# EAGLE schematic zx80 SD_12 (smd) build006.7(STM32) (EAGLE 9.6.2)

## Sheet 1 of 2
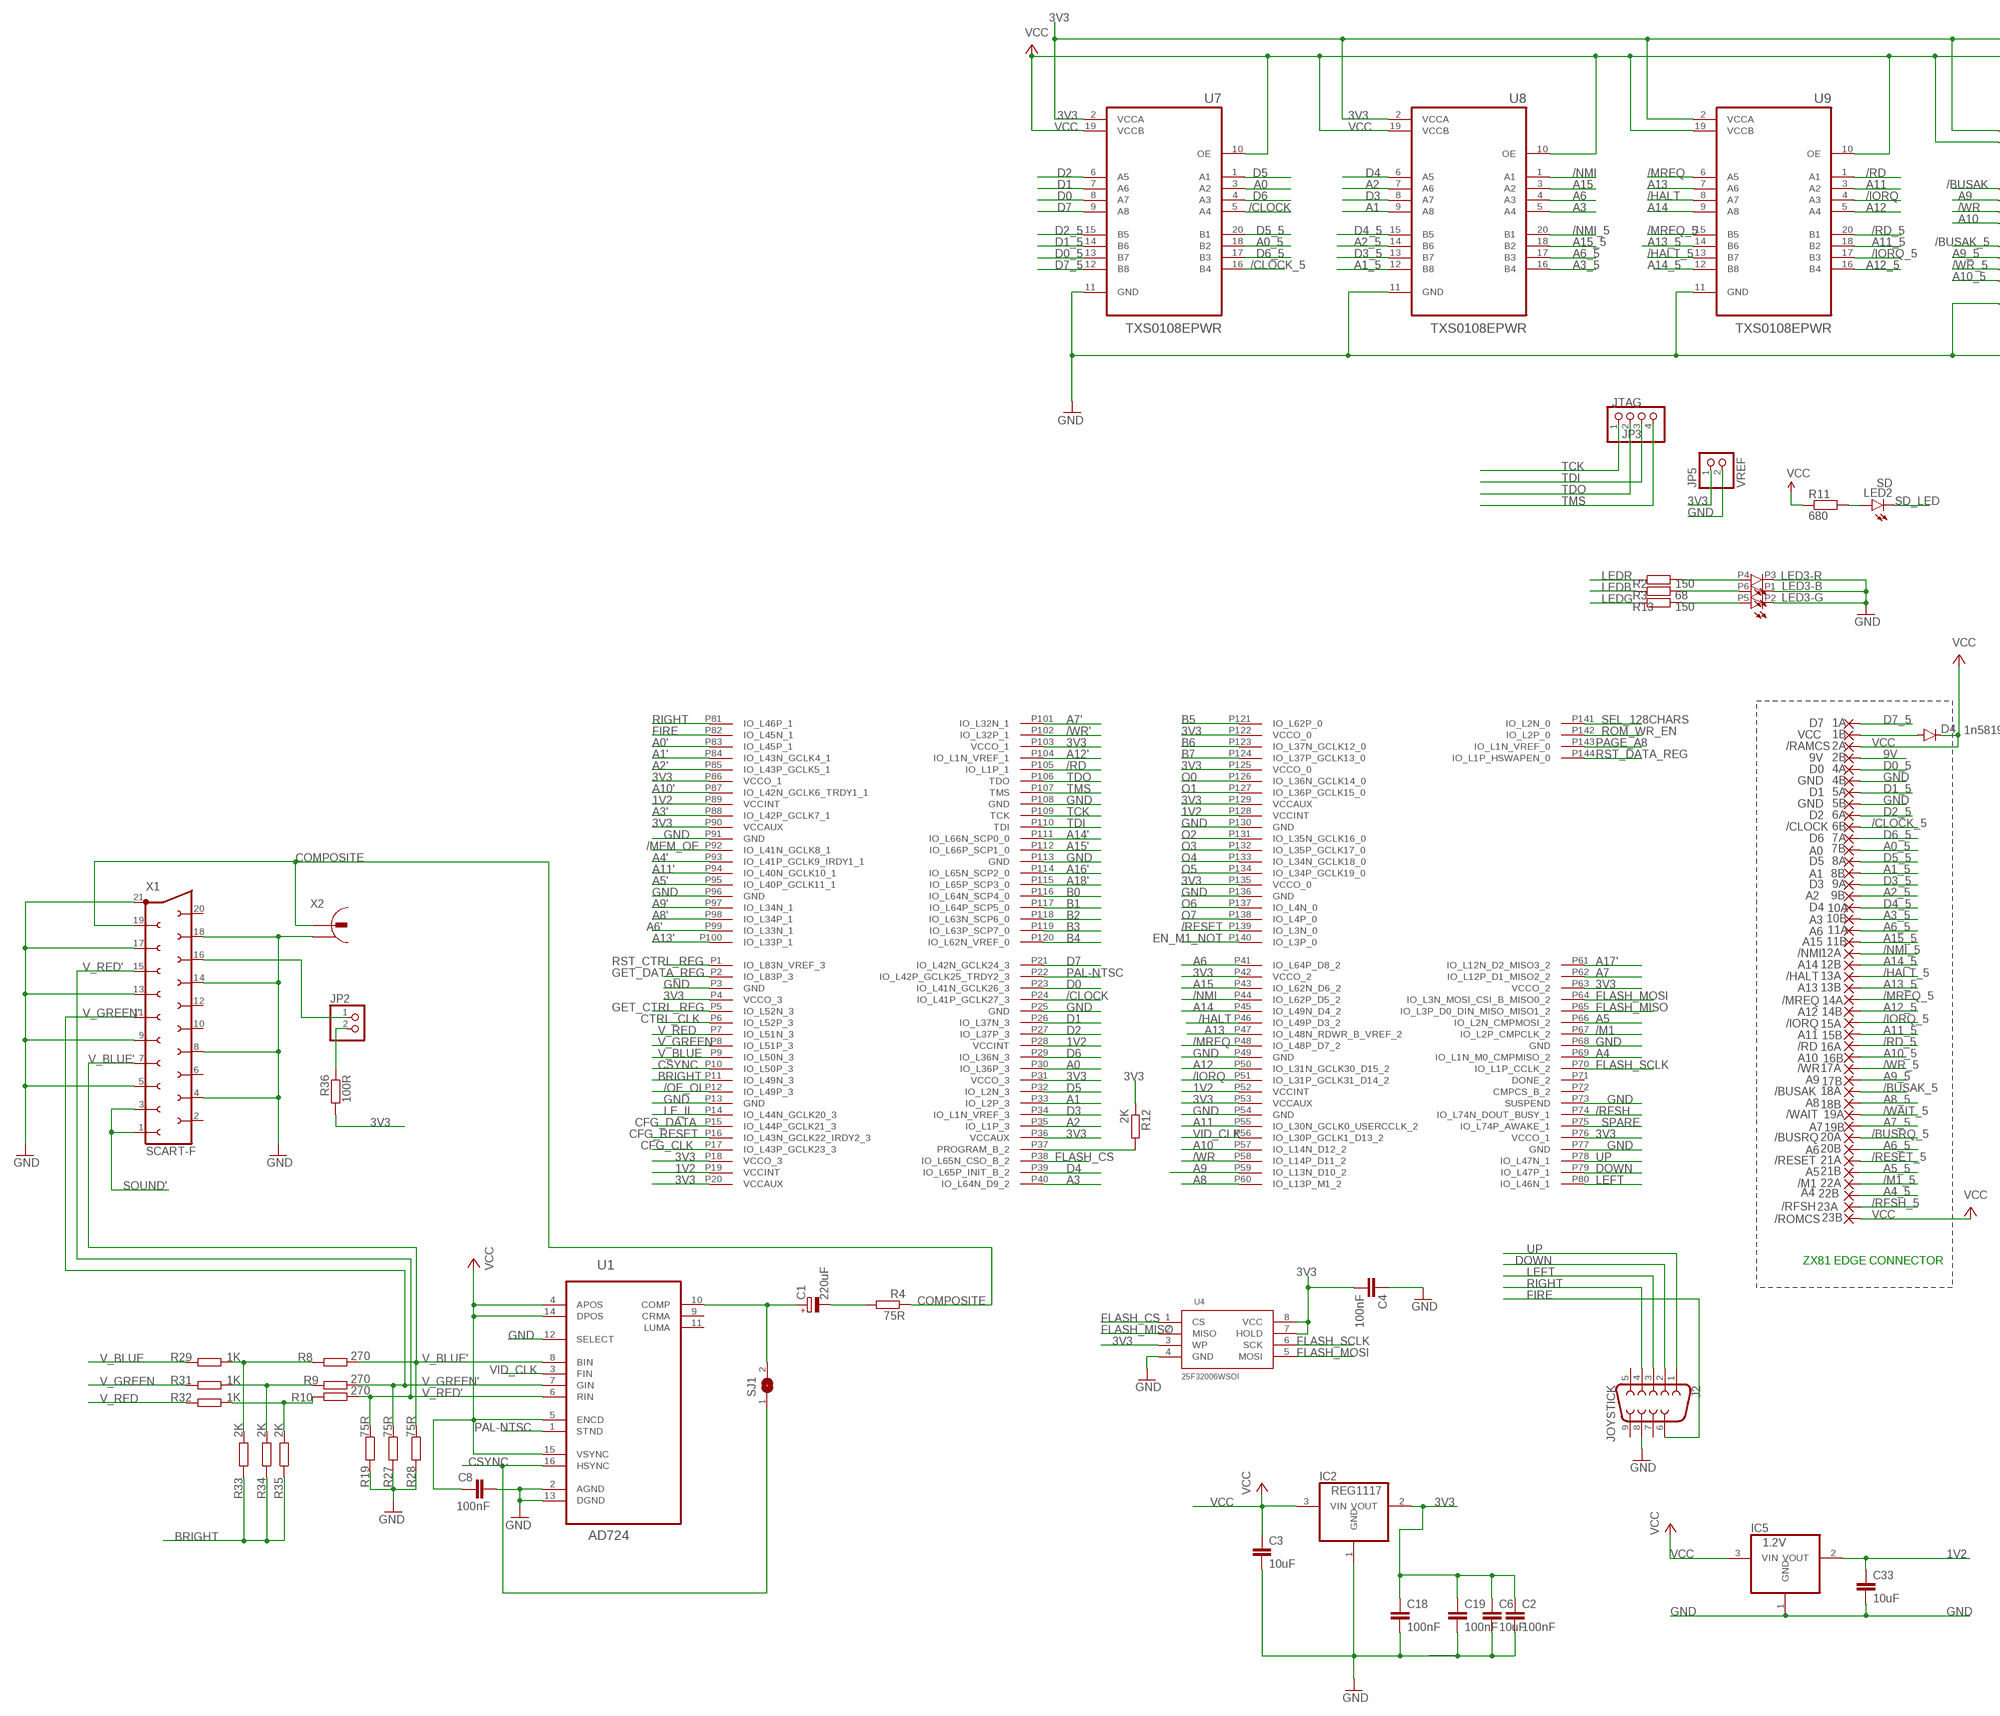
[diagram p0: schematic, sheet 1, part 1 of 2]
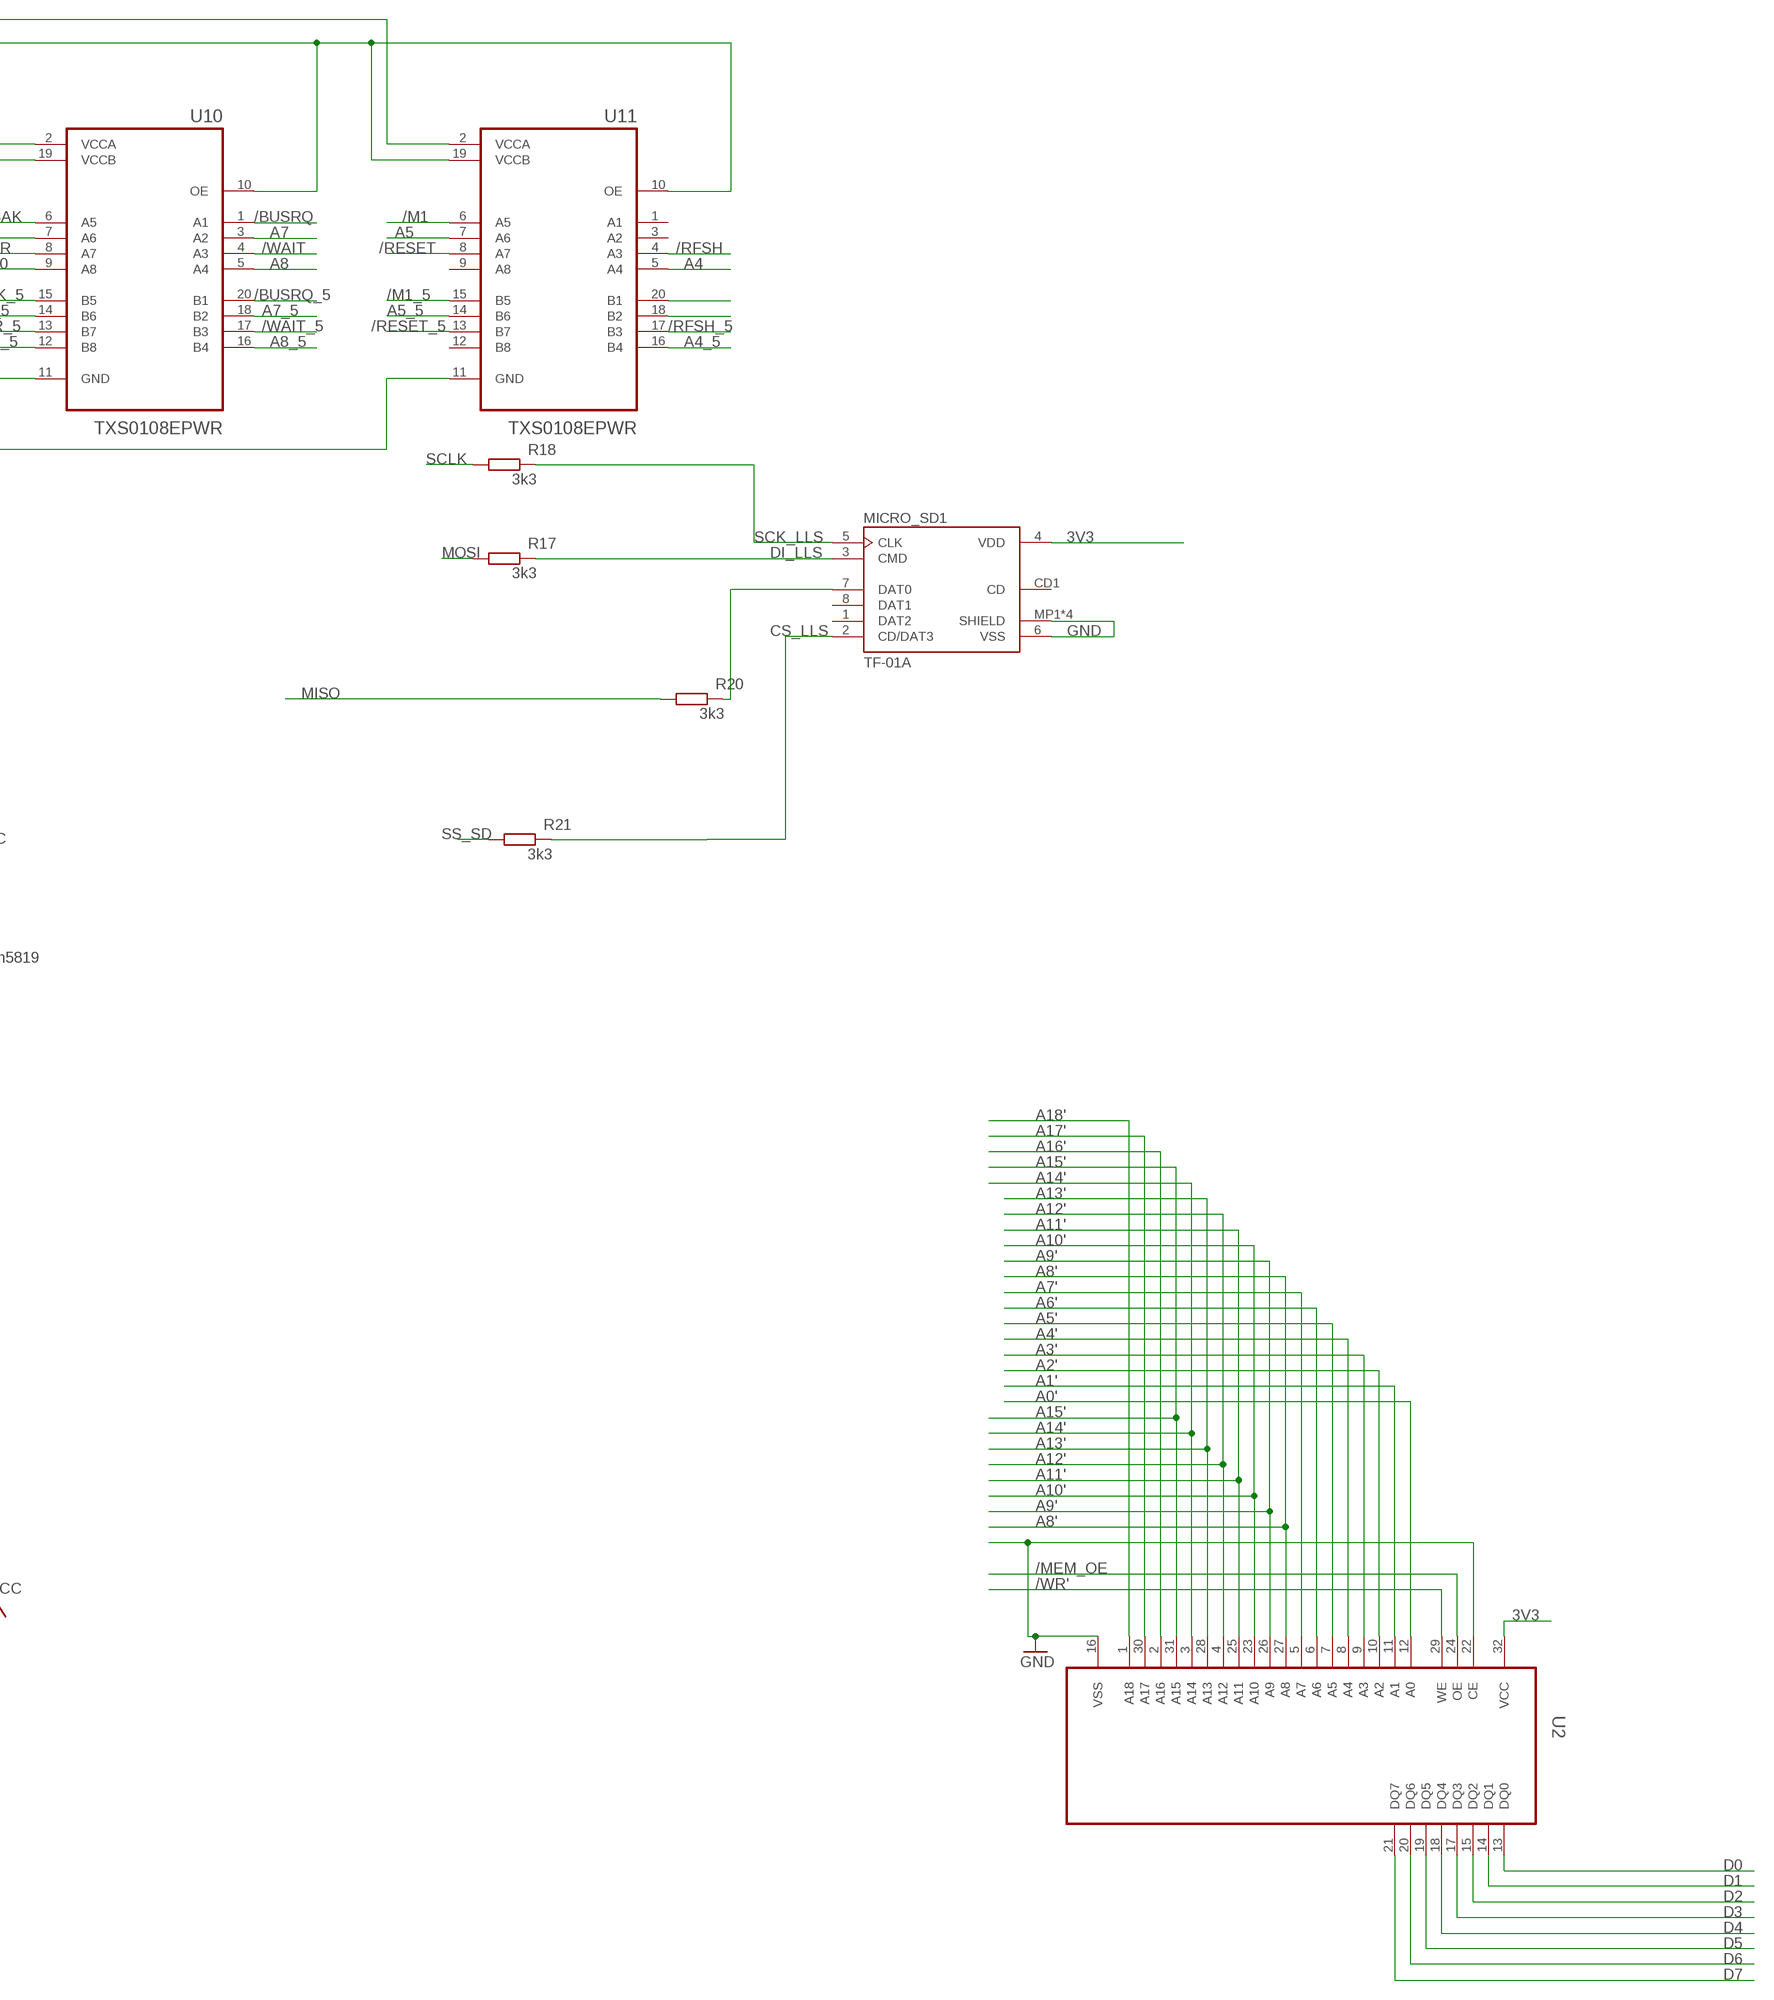
[diagram p1: schematic, sheet 1, part 2 of 2]

### Parts
1A  D7  SMD2EDGEPIN  [EDGEPIN]
1B  VCC  SMD2EDGEPIN  [EDGEPIN]
2A  /RAMCS  SMD2EDGEPIN  [EDGEPIN]
2B  9V  SMD2EDGEPIN  [EDGEPIN]
4A  D0  SMD2EDGEPIN  [EDGEPIN]
4B  GND  SMD2EDGEPIN  [EDGEPIN]
5A  D1  SMD2EDGEPIN  [EDGEPIN]
5B  GND  SMD2EDGEPIN  [EDGEPIN]
6A  D2  SMD2EDGEPIN  [EDGEPIN]
6B  /CLOCK  SMD2EDGEPIN  [EDGEPIN]
7A  D6  SMD2EDGEPIN  [EDGEPIN]
7B  A0  SMD2EDGEPIN  [EDGEPIN]
8A  D5  SMD2EDGEPIN  [EDGEPIN]
8B  A1  SMD2EDGEPIN  [EDGEPIN]
9A  D3  SMD2EDGEPIN  [EDGEPIN]
9B  A2  SMD2EDGEPIN  [EDGEPIN]
10A  D4  SMD2EDGEPIN  [EDGEPIN]
10B  A3  SMD2EDGEPIN  [EDGEPIN]
11A  A6  SMD2EDGEPIN  [EDGEPIN]
11B  A15  SMD2EDGEPIN  [EDGEPIN]
12A  /NMI  SMD2EDGEPIN  [EDGEPIN]
12B  A14  SMD2EDGEPIN  [EDGEPIN]
13A  /HALT  SMD2EDGEPIN  [EDGEPIN]
13B  A13  SMD2EDGEPIN  [EDGEPIN]
14A  /MREQ  SMD2EDGEPIN  [EDGEPIN]
14B  A12  SMD2EDGEPIN  [EDGEPIN]
15A  /IORQ  SMD2EDGEPIN  [EDGEPIN]
15B  A11  SMD2EDGEPIN  [EDGEPIN]
16A  /RD  SMD2EDGEPIN  [EDGEPIN]
16B  A10  SMD2EDGEPIN  [EDGEPIN]
17A  /WR  SMD2EDGEPIN  [EDGEPIN]
17B  A9  SMD2EDGEPIN  [EDGEPIN]
18A  /BUSAK  SMD2EDGEPIN  [EDGEPIN]
18B  A8  SMD2EDGEPIN  [EDGEPIN]
19A  /WAIT  SMD2EDGEPIN  [EDGEPIN]
19B  A7  SMD2EDGEPIN  [EDGEPIN]
20A  /BUSRQ  SMD2EDGEPIN  [EDGEPIN]
20B  A6  SMD2EDGEPIN  [EDGEPIN]
21A  /RESET  SMD2EDGEPIN  [EDGEPIN]
21B  A5  SMD2EDGEPIN  [EDGEPIN]
22A  /M1  SMD2EDGEPIN  [EDGEPIN]
22B  A4  SMD2EDGEPIN  [EDGEPIN]
23A  /RFSH  SMD2EDGEPIN  [EDGEPIN]
23B  /ROMCS  SMD2EDGEPIN  [EDGEPIN]
C1  220uF  CPOL-EUUD-6,3X7,7  [UD-6,3X7,7_NICHICON]
C2  100nF  C-EUC0603  [C0603]
C3  10uF  C-EUC0603  [C0603]
C4  100nF  C-EUC0603  [C0603]
C6  10uF  C-EUC0603  [C0603]
C8  100nF  C-EUC0603K  [C0603K]
C18  100nF  C-EUC0603  [C0603]
C19  100nF  C-EUC0603  [C0603]
C33  10uF  C-EUC0603  [C0603]
D4  1n5819  DIODE-SOD323-W  [SOD323-W]
IC2  REG1117  [SOT223]
IC5  1.2V  REG1117  [SOT223]
J2  JOYSTICK  DB9MALE  [DB9_MALE]
JP2  PINHD-1X2  [1X02]
JP3  JTAG  PINHD-1X4  [1X04]
JP5  VREF  PINHD-1X2  [1X02]
LED2  SD  LEDCHIPLED_0805  [CHIPLED_0805]
LED3  STATUS  3535RGB3535RGB  [3535-PLCC6]
MICRO_SD1  TF-01A  [TF-01A]
R2  150  R-EU_R0603  [R0603]
R3  68  R-EU_R0603  [R0603]
R4  75R  R-EU_R0603  [R0603]
R8  270  R-EU_R0603  [R0603]
R9  270  R-EU_R0603  [R0603]
R10  270  R-EU_R0603  [R0603]
R11  680  R-EU_R0603  [R0603]
R12  2K  R-EU_R0402  [R0402]
R13  150  R-EU_R0603  [R0603]
R17  3k3  R-EU_R0603  [R0603]
R18  3k3  R-EU_R0603  [R0603]
R19  75R  R-EU_R0603  [R0603]
R20  3k3  R-EU_R0603  [R0603]
R21  3k3  R-EU_R0603  [R0603]
R27  75R  R-EU_R0603  [R0603]
R28  75R  R-EU_R0603  [R0603]
R29  1K  R-EU_R0402  [R0402]
R31  1K  R-EU_R0402  [R0402]
R32  1K  R-EU_R0402  [R0402]
R33  2K  R-EU_R0402  [R0402]
R34  2K  R-EU_R0402  [R0402]
R35  2K  R-EU_R0402  [R0402]
R36  100R  R-EU_R0603  [R0603]
SJ1  SJ  [SJ]
U1  AD724  AD724JRZ  [SOIC127P1032X265-16N]
U2  AS6C4008  AS6C4008-55SINSOP5  [SOP32-5]
U4  25F32006WSOI  SPI_FLASH-X25XXSMD1  [SO08-EIAJ]
U6  XC6SLX9-2TQG144C  [TQ144]
U7  TXS0108EPWR  [SOP65P640X120-20N]
U8  TXS0108EPWR  [SOP65P640X120-20N]
U9  TXS0108EPWR  [SOP65P640X120-20N]
U10  TXS0108EPWR  [SOP65P640X120-20N]
U11  TXS0108EPWR  [SOP65P640X120-20N]
X1  SCART-F  [SCART-F]
X2  CON-CONRAD_736880-2P  [3P]

### Nets
1V2 [VCC]: C33.1 IC5.2(VOUT) U6.P19(VCCINT) U6.P28(VCCINT) U6.P52(VCCINT) U6.P89(VCCINT) U6.P128(VCCINT)
3V3 [VCC]: C2.1 C4.2 C6.1 C18.1 C19.1 IC2.2(VOUT) JP5.1 MICRO_SD1.4(VDD) R12.1 R36.2 U2.32(VCC) U4.3(WP) U4.7(HOLD) U4.8(VCC) U6.P4(VCCO_3) U6.P18(VCCO_3) U6.P20(VCCAUX) U6.P31(VCCO_3) U6.P36(VCCAUX) U6.P42(VCCO_2) U6.P53(VCCAUX) U6.P63(VCCO_2) U6.P76(VCCO_1) U6.P86(VCCO_1) U6.P90(VCCAUX) U6.P103(VCCO_1) U6.P122(VCCO_0) U6.P125(VCCO_0) U6.P129(VCCAUX) U6.P135(VCCO_0) U7.2(VCCA) U8.2(VCCA) U9.2(VCCA) U10.2(VCCA) U11.2(VCCA) ; also sheet 2
9V [VCC]: 2B.1(P)
/BUSAK: U10.6(A5)
/BUSAK_5: 18A.1(P) U10.15(B5)
/BUSRQ: U10.1(A1)
/BUSRQ_5: 20A.1(P) U10.20(B1)
/CLOCK: U6.P24(IO_L41P_GCLK27_3) U7.5(A4)
/CLOCK_5: 6B.1(P) U7.16(B4)
/HALT: U6.P46(IO_L49P_D3_2) U9.8(A7)
/HALT_5: 13A.1(P) U9.13(B7)
/IORQ: U6.P51(IO_L31P_GCLK31_D14_2) U9.4(A3)
/IORQ_5: 15A.1(P) U9.17(B3)
/M1: U6.P67(IO_L2P_CMPCLK_2) U11.6(A5)
/M1_5: 22A.1(P) U11.15(B5)
/MEM_OE: U2.24(OE) U6.P92(IO_L41N_GCLK8_1)
/MREQ: U6.P48(IO_L48P_D7_2) U9.6(A5)
/MREQ_5: 14A.1(P) U9.15(B5)
/NMI: U6.P44(IO_L62P_D5_2) U8.1(A1)
/NMI_5: 12A.1(P) U8.20(B1)
/OE_OL: U6.P12(IO_L49P_3) ; also sheet 2
/RD: U6.P105(IO_L1P_1) U9.1(A1)
/RD_5: 16A.1(P) U9.20(B1)
/RESET: U6.P139(IO_L3N_0) U11.8(A7) ; also sheet 2
/RESET_5: 21A.1(P) U11.13(B7)
/RFSH: U6.P74(IO_L74N_DOUT_BUSY_1) U11.4(A3)
/RFSH_5: 23A.1(P) U11.17(B3)
/WAIT: U10.4(A3) ; also sheet 2
/WAIT_5: 19A.1(P) U10.17(B3)
/WR: U6.P58(IO_L14P_D11_2) U10.8(A7)
/WR': U2.29(WE) U6.P102(IO_L32P_1) ; also sheet 2
/WR_5: 17A.1(P) U10.13(B7)
A0: U6.P30(IO_L36P_3) U7.3(A2)
A0': U2.12(A0) U6.P83(IO_L45P_1) ; also sheet 2
A0_5: 7B.1(P) U7.18(B2)
A1: U6.P33(IO_L2P_3) U8.9(A8)
A1': U2.11(A1) U6.P84(IO_L43N_GCLK4_1) ; also sheet 2
A1_5: 8B.1(P) U8.12(B8)
A2: U6.P35(IO_L1P_3) U8.7(A6)
A2': U2.10(A2) U6.P85(IO_L43P_GCLK5_1) ; also sheet 2
A2_5: 9B.1(P) U8.14(B6)
A3: U6.P40(IO_L64N_D9_2) U8.5(A4)
A3': U2.9(A3) U6.P88(IO_L42P_GCLK7_1) ; also sheet 2
A3_5: 10B.1(P) U8.16(B4)
A4: U6.P69(IO_L1N_M0_CMPMISO_2) U11.5(A4)
A4': U2.8(A4) U6.P93(IO_L41P_GCLK9_IRDY1_1) ; also sheet 2
A4_5: 22B.1(P) U11.16(B4)
A5: U6.P66(IO_L2N_CMPMOSI_2) U11.7(A6)
A5': U2.7(A5) U6.P95(IO_L40P_GCLK11_1) ; also sheet 2
A5_5: 21B.1(P) U11.14(B6)
A6: U6.P41(IO_L64P_D8_2) U8.4(A3)
A6': U2.6(A6) U6.P99(IO_L33N_1) ; also sheet 2
A6_5: 11A.1(P) 20B.1(P) U8.17(B3)
A7: U6.P62(IO_L12P_D1_MISO2_2) U10.3(A2)
A7': U2.5(A7) U6.P101(IO_L32N_1) ; also sheet 2
A7_5: 19B.1(P) U10.18(B2)
A8: U6.P60(IO_L13P_M1_2) U10.5(A4)
A8': U2.27(A8) U6.P98(IO_L34P_1) ; also sheet 2
A8_5: 18B.1(P) U10.16(B4)
A9: U6.P59(IO_L13N_D10_2) U10.7(A6)
A9': U2.26(A9) U6.P97(IO_L34N_1) ; also sheet 2
A9_5: 17B.1(P) U10.14(B6)
A10: U6.P57(IO_L14N_D12_2) U10.9(A8)
A10': U2.23(A10) U6.P87(IO_L42N_GCLK6_TRDY1_1) ; also sheet 2
A10_5: 16B.1(P) U10.12(B8)
A11: U6.P55(IO_L30N_GCLK0_USERCCLK_2) U9.3(A2)
A11': U2.25(A11) U6.P94(IO_L40N_GCLK10_1) ; also sheet 2
A11_5: 15B.1(P) U9.18(B2)
A12: U6.P50(IO_L31N_GCLK30_D15_2) U9.5(A4)
A12': U2.4(A12) U6.P104(IO_L1N_VREF_1) ; also sheet 2
A12_5: 14B.1(P) U9.16(B4)
A13: U6.P47(IO_L48N_RDWR_B_VREF_2) U9.7(A6)
A13': U2.28(A13) U6.P100(IO_L33P_1) ; also sheet 2
A13_5: 13B.1(P) U9.14(B6)
A14: U6.P45(IO_L49N_D4_2) U9.9(A8)
A14': U2.3(A14) U6.P111(IO_L66N_SCP0_0) ; also sheet 2
A14_5: 12B.1(P) U9.12(B8)
A15: U6.P43(IO_L62N_D6_2) U8.3(A2)
A15': U2.31(A15) U6.P112(IO_L66P_SCP1_0) ; also sheet 2
A15_5: 11B.1(P) U8.18(B2)
A16': U2.2(A16) U6.P114(IO_L65N_SCP2_0) ; also sheet 2
A17': U2.30(A17) U6.P61(IO_L12N_D2_MISO3_2) ; also sheet 2
A18': U2.1(A18) U6.P115(IO_L65P_SCP3_0) ; also sheet 2
B0: U6.P116(IO_L64N_SCP4_0) ; also sheet 2
B1: U6.P117(IO_L64P_SCP5_0) ; also sheet 2
B2: U6.P118(IO_L63N_SCP6_0) ; also sheet 2
B3: U6.P119(IO_L63P_SCP7_0) ; also sheet 2
B4: U6.P120(IO_L62N_VREF_0) ; also sheet 2
B5: U6.P121(IO_L62P_0) ; also sheet 2
B6: U6.P123(IO_L37N_GCLK12_0) ; also sheet 2
B7: U6.P124(IO_L37P_GCLK13_0) ; also sheet 2
BRIGHT: R33.1 R34.1 R35.1 U6.P11(IO_L49N_3)
CFG_CLK: U6.P17(IO_L43P_GCLK23_3) ; also sheet 2
CFG_DATA: U6.P15(IO_L44P_GCLK21_3) ; also sheet 2
CFG_RESET: U6.P16(IO_L43N_GCLK22_IRDY2_3) ; also sheet 2
COMPOSITE: R4.1 X1.19 X2.2
CS_LLS: MICRO_SD1.2(CD/DAT3) R21.2
CSYNC: SJ1.1 U1.16(HSYNC) U6.P10(IO_L50P_3)
CTRL_CLK: U6.P6(IO_L52P_3) ; also sheet 2
D0: U2.13(DQ0) U6.P23(IO_L41N_GCLK26_3) U7.8(A7)
D0_5: 4A.1(P) U7.13(B7)
D1: U2.14(DQ1) U6.P26(IO_L37N_3) U7.7(A6)
D1_5: 5A.1(P) U7.14(B6)
D2: U2.15(DQ2) U6.P27(IO_L37P_3) U7.6(A5)
D2_5: 6A.1(P) U7.15(B5)
D3: U2.17(DQ3) U6.P34(IO_L1N_VREF_3) U8.8(A7)
D3_5: 9A.1(P) U8.13(B7)
D4: U2.18(DQ4) U6.P39(IO_L65P_INIT_B_2) U8.6(A5)
D4_5: 10A.1(P) U8.15(B5)
D5: U2.19(DQ5) U6.P32(IO_L2N_3) U7.1(A1)
D5_5: 8A.1(P) U7.20(B1)
D6: U2.20(DQ6) U6.P29(IO_L36N_3) U7.4(A3)
D6_5: 7A.1(P) U7.17(B3)
D7: U2.21(DQ7) U6.P21(IO_L42N_GCLK24_3) U7.9(A8)
D7_5: 1A.1(P) U7.12(B8)
DI_LLS: MICRO_SD1.3(CMD) R17.2
DOWN: J2.2 U6.P79(IO_L47P_1)
EN_M1_NOT: U6.P140(IO_L3P_0) ; also sheet 2
FIRE: J2.6 U6.P82(IO_L45N_1)
FLASH_CS: U4.1(CS) U6.P38(IO_L65N_CSO_B_2)
FLASH_MISO: U4.2(MISO) U6.P65(IO_L3P_D0_DIN_MISO_MISO1_2)
FLASH_MOSI: U4.5(MOSI) U6.P64(IO_L3N_MOSI_CSI_B_MISO0_2)
FLASH_SCLK: U4.6(SCK) U6.P70(IO_L1P_CCLK_2)
GET_CTRL_REG: U6.P5(IO_L52N_3) ; also sheet 2
GET_DATA_REG: U6.P2(IO_L83P_3) ; also sheet 2
GND [VCC]: 4B.1(P) 5B.1(P) C2.2 C3.2 C4.1 C6.2 C8.1 C18.2 C19.2 C33.2 IC2.1(GND) IC5.1(GND) J2.8 JP5.2 LED3.P1(-B:C) LED3.P2(-G:C) LED3.P3(-R:C) MICRO_SD1.6(VSS) MICRO_SD1.MP1(SHIELD) MICRO_SD1.MP2(SHIELD) MICRO_SD1.MP3(SHIELD) MICRO_SD1.MP4(SHIELD) R19.2 R27.2 R28.2 U1.2(AGND) U1.12(SELECT) U1.13(DGND) U2.16(VSS) U2.22(CE) U4.4(GND) U6.P3(GND) U6.P13(GND) U6.P25(GND) U6.P49(GND) U6.P54(GND) U6.P68(GND) U6.P73(SUSPEND) U6.P77(GND) U6.P91(GND) U6.P96(GND) U6.P108(GND) U6.P113(GND) U6.P130(GND) U6.P136(GND) U7.11(GND) U8.11(GND) U9.11(GND) U10.11(GND) U11.11(GND) X1.4 X1.5 X1.8 X1.9 X1.13 X1.14 X1.17 X1.18 X1.21 X2.1 ; also sheet 2
LE_IL: U6.P14(IO_L44N_GCLK20_3) ; also sheet 2
LEDB: R3.1 ; also sheet 2
LEDG: R13.1 ; also sheet 2
LEDR: R2.1 ; also sheet 2
LEFT: J2.3 U6.P80(IO_L46N_1)
MISO: R20.1 ; also sheet 2
MOSI: R17.1 ; also sheet 2
N$1: C1.+ SJ1.2 U1.10(COMP)
N$2: MICRO_SD1.7(DAT0) R20.2
N$3 [VCC]: 1B.1(P) D4.A
N$6: C1.- R4.2
N$10: R12.2 U6.P37(PROGRAM_B_2)
N$15: LED2.A R11.2
N$17: JP2.1 X1.16
N$26: LED3.P4(-R:A) R2.2
N$27: LED3.P6(-B:A) R3.2
N$28: LED3.P5(-G:A) R13.2
N$30: JP2.2 R36.1
N$33: R8.2 R29.2 R33.2
N$34: R9.2 R31.2 R34.2
N$35: R10.2 R32.2 R35.2
N$41: U11.20(B1)
N$42: U11.18(B2)
O0: U6.P126(IO_L36N_GCLK14_0) ; also sheet 2
O1: U6.P127(IO_L36P_GCLK15_0) ; also sheet 2
O2: U6.P131(IO_L35N_GCLK16_0) ; also sheet 2
O3: U6.P132(IO_L35P_GCLK17_0) ; also sheet 2
O4: U6.P133(IO_L34N_GCLK18_0) ; also sheet 2
O5: U6.P134(IO_L34P_GCLK19_0) ; also sheet 2
O6: U6.P137(IO_L4N_0) ; also sheet 2
O7: U6.P138(IO_L4P_0) ; also sheet 2
PAGE_A8: U6.P143(IO_L1N_VREF_0) ; also sheet 2
PAL-NTSC: U1.1(STND) U6.P22(IO_L42P_GCLK25_TRDY2_3)
RIGHT: J2.4 U6.P81(IO_L46P_1)
ROM_WR_EN: U6.P142(IO_L2P_0) ; also sheet 2
RST_CTRL_REG: U6.P1(IO_L83N_VREF_3) ; also sheet 2
RST_DATA_REG: U6.P144(IO_L1P_HSWAPEN_0) ; also sheet 2
SCK_LLS: MICRO_SD1.5(CLK) R18.2
SCLK: R18.1 ; also sheet 2
SD_LED: LED2.C ; also sheet 2
SEL_128CHARS: U6.P141(IO_L2N_0) ; also sheet 2
SOUND': X1.1 X1.3 ; also sheet 2
SPARE: U6.P75(IO_L74P_AWAKE_1)
SS_SD: R21.1 ; also sheet 2
TCK: JP3.1 U6.P109(TCK)
TDI: JP3.3 U6.P110(TDI)
TDO: JP3.2 U6.P106(TDO)
TMS: JP3.4 U6.P107(TMS)
UP: J2.1 U6.P78(IO_L47N_1)
V_BLUE: R29.1 U6.P9(IO_L50N_3)
V_BLUE': R8.1 R28.1 U1.8(BIN) X1.7
V_GREEN: R31.1 U6.P8(IO_L51P_3)
V_GREEN': R9.1 R27.1 U1.7(GIN) X1.11
V_RED: R32.1 U6.P7(IO_L51N_3)
V_RED': R10.1 R19.1 U1.6(RIN) X1.15
VCC [VCC]: 2A.1(P) 23B.1(P) C3.1 C8.2 D4.C IC2.3(VIN) IC5.3(VIN) R11.1 U1.4(APOS) U1.5(ENCD) U1.14(DPOS) U1.15(VSYNC) U7.10(OE) U7.19(VCCB) U8.10(OE) U8.19(VCCB) U9.10(OE) U9.19(VCCB) U10.10(OE) U10.19(VCCB) U11.10(OE) U11.19(VCCB) ; also sheet 2
VID_CLK: U1.3(FIN) U6.P56(IO_L30P_GCLK1_D13_2)
Unconnected: J2.5 J2.7 J2.9 MICRO_SD1.1(DAT2) MICRO_SD1.8(DAT1) MICRO_SD1.CD1(CD) U1.9(CRMA) U1.11(LUMA) U6.P71(DONE_2) U6.P72(CMPCS_B_2) U11.1(A1) U11.3(A2) U11.9(A8) U11.12(B8) X1.2 X1.6 X1.10 X1.12 X1.20

### Notes on the sheet
- ZX81 EDGE CONNECTOR

## Sheet 2 of 2
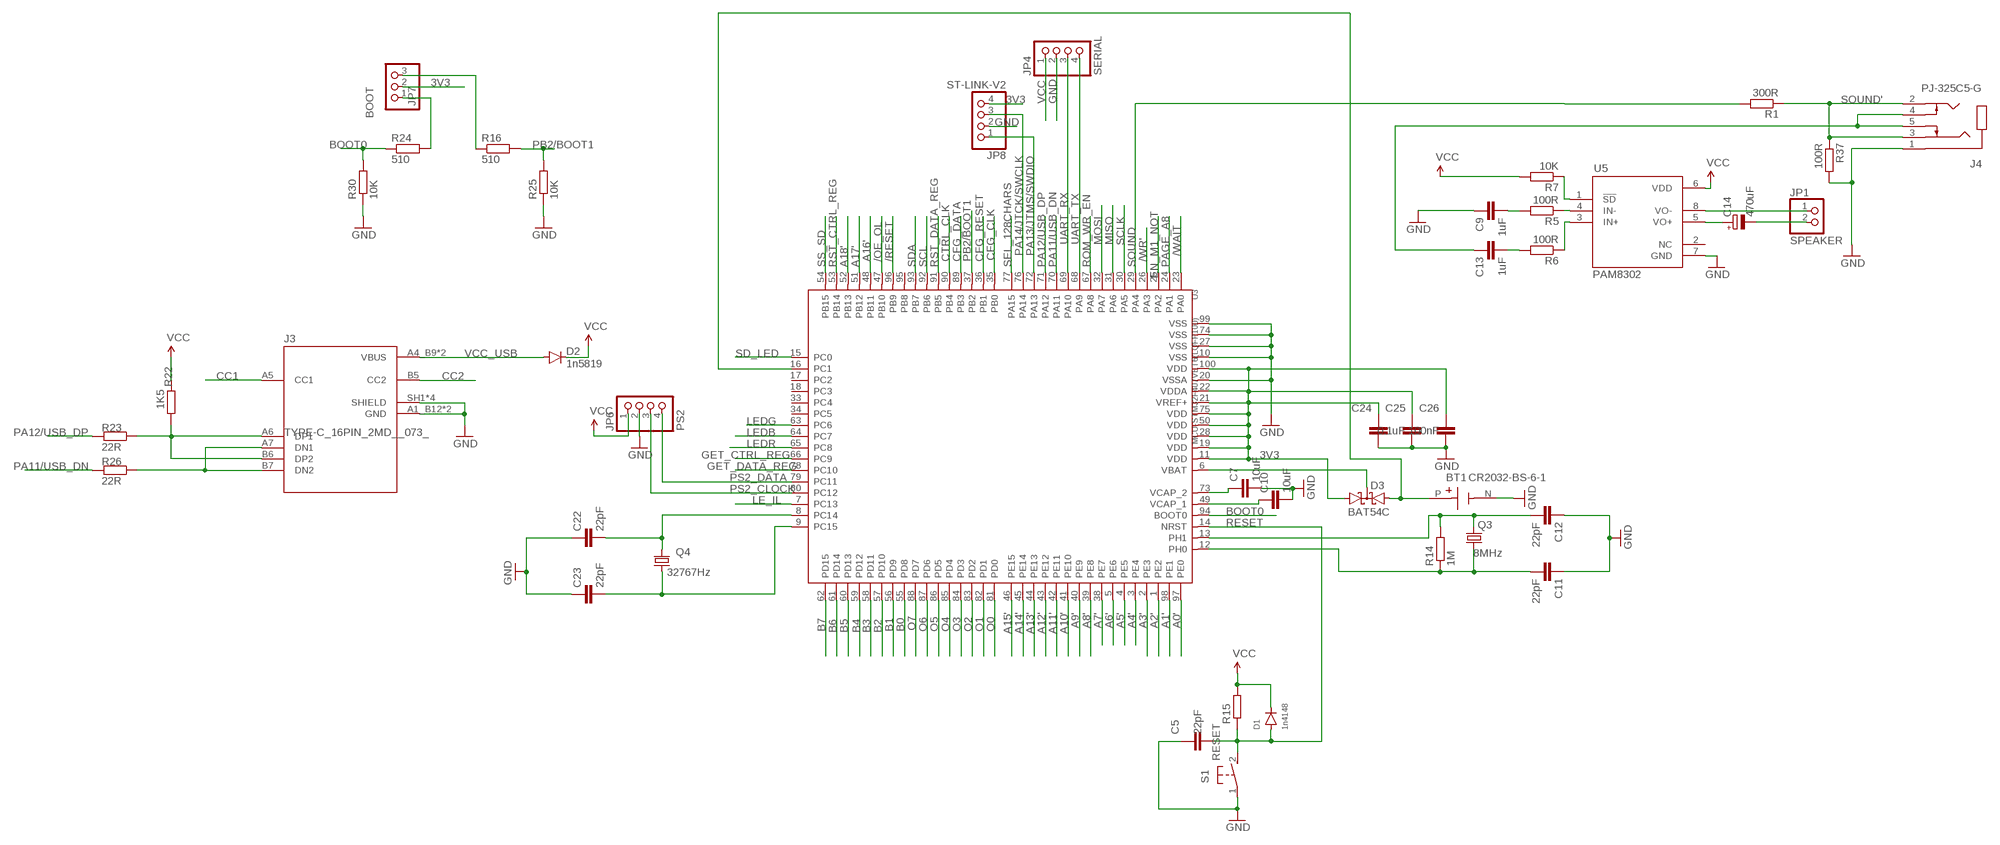
[diagram p2: schematic, sheet 2]

### Parts
BT1  CR2032-BS-6-1  [BAT_CR2032-BS-6-1]
C5  22pF  C-EUC0603  [C0603]
C7  10uF  C-EUC0603  [C0603]
C9  1uF  C-EUC0603  [C0603]
C10  10uF  C-EUC0603  [C0603]
C11  22pF  C-EUC0603  [C0603]
C12  22pF  C-EUC0603  [C0603]
C13  1uF  C-EUC0603  [C0603]
C14  470uF  CPOL-EUUD-6,3X7,7  [UD-6,3X7,7_NICHICON]
C22  22pF  C-EUC0603  [C0603]
C23  22pF  C-EUC0603  [C0603]
C24  0.1uF  C-EUC0603  [C0603]
C25  0.1uF  C-EUC0603  [C0603]
C26  100nF  C-EUC0603  [C0603]
D1  1n4148  DIODE-SOD123  [SOD123]
D2  1n5819  DIODE-SOD323-W  [SOD323-W]
D3  BAT54C  [SOT23]
J3  TYPE-C_16PIN_2MD__073_  [SHOUHAN_TYPE-C_16PIN_2MD__073_]
J4  PJ-325C5-G  [XKB_PJ-325C5-G]
JP1  SPEAKER  PINHD-1X2  [1X02]
JP4  SERIAL  PINHD-1X4  [1X04]
JP6  PS2  PINHD-1X4  [1X04]
JP7  BOOT  PINHD-1X3  [1X03]
JP8  ST-LINK-V2  PINHD-1X4  [1X04]
Q3  8MHz  KX-7  [3.2X2.5_KX-7]
Q4  32767Hz  KX-327-NHT  [3.2X1.5]
R1  300R  R-EU_R0603  [R0603]
R5  100R  R-EU_R0603  [R0603]
R6  100R  R-EU_R0603  [R0603]
R7  10K  R-EU_R0603  [R0603]
R14  1M  R-EU_R0402  [R0402]
R15  3k3  R-EU_R0603  [R0603]
R16  510  R-EU_R0603  [R0603]
R22  1K5  R-EU_R0603  [R0603]
R23  22R  R-EU_R0603  [R0603]
R24  510  R-EU_R0603  [R0603]
R25  10K  R-EU_R0603  [R0603]
R26  22R  R-EU_R0603  [R0603]
R30  10K  R-EU_R0603  [R0603]
R37  100R  R-EU_R0603  [R0603]
S1  RESET  31-XX  [B3F-31XX]
U3  MCU-STM32F407VET6(LQFP100)  [LQFP100-0.5-13.8X13.8MM]
U5  PAM8302  PAM8302AADCR  [SOIC127P600X170-8N]

### Nets
3V3 [VCC]: C24.1 C25.1 C26.1 D3.1(A1) JP7.2 JP8.4 U3.11(VDD) U3.19(VDD) U3.21(VREF+) U3.22(VDDA) U3.28(VDD) U3.50(VDD) U3.75(VDD) U3.100(VDD) ; also sheet 1
/OE_OL: U3.47(PB10) ; also sheet 1
/RESET: U3.96(PB9) ; also sheet 1
/WAIT: U3.23(PA0) ; also sheet 1
/WR': U3.26(PA3) ; also sheet 1
A0': U3.97(PE0) ; also sheet 1
A1': U3.98(PE1) ; also sheet 1
A2': U3.1(PE2) ; also sheet 1
A3': U3.2(PE3) ; also sheet 1
A4': U3.3(PE4) ; also sheet 1
A5': U3.4(PE5) ; also sheet 1
A6': U3.5(PE6) ; also sheet 1
A7': U3.38(PE7) ; also sheet 1
A8': U3.39(PE8) ; also sheet 1
A9': U3.40(PE9) ; also sheet 1
A10': U3.41(PE10) ; also sheet 1
A11': U3.42(PE11) ; also sheet 1
A12': U3.43(PE12) ; also sheet 1
A13': U3.44(PE13) ; also sheet 1
A14': U3.45(PE14) ; also sheet 1
A15': U3.46(PE15) ; also sheet 1
A16': U3.48(PB11) ; also sheet 1
A17': U3.51(PB12) ; also sheet 1
A18': U3.52(PB13) ; also sheet 1
B0: U3.55(PD8) ; also sheet 1
B1: U3.56(PD9) ; also sheet 1
B2: U3.57(PD10) ; also sheet 1
B3: U3.58(PD11) ; also sheet 1
B4: U3.59(PD12) ; also sheet 1
B5: U3.60(PD13) ; also sheet 1
B6: U3.61(PD14) ; also sheet 1
B7: U3.62(PD15) ; also sheet 1
BAT: BT1.P(POS) D3.2(A2) U3.16(PC1)
BOOT0: R24.1 R30.2 U3.94(BOOT0)
CC1: J3.A5(CC1)
CC2: J3.B5(CC2)
CFG_CLK: U3.35(PB0) ; also sheet 1
CFG_DATA: U3.89(PB3) ; also sheet 1
CFG_RESET: U3.36(PB1) ; also sheet 1
CTRL_CLK: U3.90(PB4) ; also sheet 1
EN_M1_NOT: U3.25(PA2) ; also sheet 1
GET_CTRL_REG: U3.66(PC9) ; also sheet 1
GET_DATA_REG: U3.78(PC10) ; also sheet 1
GND [VCC]: BT1.N(NEG) C5.1 C7.2 C9.1 C10.2 C11.1 C12.1 C22.1 C23.1 C24.2 C25.2 C26.2 J3.A1_B12(GND) J3.B1_A12(GND) J3.SH1(SHIELD) J3.SH2(SHIELD) J3.SH3(SHIELD) J3.SH4(SHIELD) J4.1 JP4.2 JP6.2 JP8.2 R25.1 R30.1 R37.2 S1.1(P) U3.10(VSS) U3.20(VSSA) U3.27(VSS) U3.74(VSS) U3.99(VSS) U5.7(GND) ; also sheet 1
LE_IL: U3.7(PC13) ; also sheet 1
LEDB: U3.64(PC7) ; also sheet 1
LEDG: U3.63(PC6) ; also sheet 1
LEDR: U3.65(PC8) ; also sheet 1
MISO: U3.31(PA6) ; also sheet 1
MOSI: U3.32(PA7) ; also sheet 1
N$4: J3.A6(DP1) J3.B6(DP2) R22.1 R23.1
N$5: D3.3(CC) U3.6(VBAT)
N$7: R6.1 U5.3(IN+)
N$8: R5.1 U5.4(IN-)
N$9: R7.1 U5.1(!SD)
N$11: C7.1 U3.73(VCAP_2)
N$12: J3.A7(DN1) J3.B7(DN2) R26.1
N$13: C9.2 R5.2
N$14: C13.2 R6.2
N$16: C10.1 U3.49(VCAP_1)
N$18: C11.2 Q3.1 R14.1 U3.12(PH0)
N$19: C12.2 Q3.3 R14.2 U3.13(PH1)
N$20: JP7.3 R16.1
N$21: JP7.1 R24.2
N$22: C22.2 Q4.2 U3.8(PC14)
N$23: C23.2 Q4.1 U3.9(PC15)
N$24: C14.+ U5.5(VO+)
N$25: JP1.1 U5.8(VO-)
N$29: C13.1 J4.4 J4.5
N$37: C14.- JP1.2
O0: U3.81(PD0) ; also sheet 1
O1: U3.82(PD1) ; also sheet 1
O2: U3.83(PD2) ; also sheet 1
O3: U3.84(PD3) ; also sheet 1
O4: U3.85(PD4) ; also sheet 1
O5: U3.86(PD5) ; also sheet 1
O6: U3.87(PD6) ; also sheet 1
O7: U3.88(PD7) ; also sheet 1
PA11/USB_DN: R26.2 U3.70(PA11)
PA12/USB_DP: R23.2 U3.71(PA12)
PA13/JTMS/SWDIO: JP8.1 U3.72(PA13)
PA14/JTCK/SWCLK: JP8.3 U3.76(PA14)
PAGE_A8: U3.24(PA1) ; also sheet 1
PB2/BOOT1: R16.2 R25.2 U3.37(PB2)
PS2_CLOCK: JP6.3 U3.80(PC12)
PS2_DATA: JP6.4 U3.79(PC11)
RESET: C5.2 D1.A R15.1 S1.2(S) U3.14(NRST)
ROM_WR_EN: U3.67(PA8) ; also sheet 1
RST_CTRL_REG: U3.53(PB14) ; also sheet 1
RST_DATA_REG: U3.91(PB5) ; also sheet 1
SCL: U3.92(PB6)
SCLK: U3.30(PA5) ; also sheet 1
SD_LED: U3.15(PC0) ; also sheet 1
SDA: U3.93(PB7)
SEL_128CHARS: U3.77(PA15) ; also sheet 1
SOUND: R1.2 U3.29(PA4)
SOUND': J4.2 J4.3 R1.1 R37.1 ; also sheet 1
SS_SD: U3.54(PB15) ; also sheet 1
UART_RX: JP4.3 U3.69(PA10)
UART_TX: JP4.4 U3.68(PA9)
VCC [VCC]: D1.C D2.C JP4.1 JP6.1 R7.2 R15.2 R22.2 U5.6(VDD) ; also sheet 1
VCC_USB [VCC]: D2.A J3.A4_B9(VBUS) J3.B4_A9(VBUS)
Unconnected: U3.17(PC2) U3.18(PC3) U3.33(PC4) U3.34(PC5) U3.95(PB8) U5.2(NC)

## Library data of the parts
1A 1B 2A 2B 4A 4B 5A 5B 6A 6B 7A 7B 8A 8B 9A 9B 10A 10B 11A 11B 12A 12B 13A 13B 14A 14B 15A 15B 16A 16B 17A 17B 18A 18B 19A 19B 20A 20B 21A 21B 22A 22B 23A 23B = wirepad:SMD2: SMD PAD
BT1 = CR2032-BS-6-1:CR2032-BS-6-1: Check availability; AVAILABILITY: Not in stock; CHECK_PRICES: https://www.snapeda.com/parts/CR2032-BS-6-1/Shenzhen+Huacan+Tianlu+Electronics+Co.%252C+Ltd./view-part/?ref=eda; DESCRIPTION: Battery base CR2032 SMD Battery Connectors ROHS; MF: Shenzhen Q&J Electronics Co. Ltd; MP: CR2032-BS-6-1; PACKAGE: Package; PRICE: None; SNAPEDA_LINK: https://www.snapeda.com/parts/CR2032-BS-6-1/Shenzhen+Huacan+Tianlu+Electronics+Co.%252C+Ltd./view-part/?ref=snap
C1 C14 = rcl:CPOL-EU: POLARIZED CAPACITOR, European symbol; SPICEPREFIX: C
C2-C13 C18 C19 C22-C26 C33 = rcl:C-EU: CAPACITOR, European symbol; SPICEPREFIX: C
D1 D2 D4 = diode:DIODE-: DIODE
D3 = diode:BAT54C: Schottky Diodes Source: Fairchild .. BAT54.pdf
IC2 IC5 = burr-brown:REG1117: 800mA and 1A Low Dropout (LDO) Positive Regulator 1.8V, 2.5V, 2.85V, 3.3V, 5V, and Adj; MPN: REG1117; OC_FARNELL: 1097566; OC_NEWARK: 14P6981
J2 = SparkFun-Connectors:DB9: DB9 Connector Standard DB9 (D-Sub 9) serial connector. Can be used for CAN bus as well as RS485 and RS232. Footprint production proven. Here is the female version connector we sell at SparkFun: 9 Pin Female Serial Connector - PCB Mount (PRT-00429) This connector has been used on the following SparkFun products: SparkFun RS232 Shifter - SMD (PRT-00449) SparkFun RS232 Shifter SMD (No DB9) (PRT-08780); PROD_ID: CONN-09904
J3 = TYPE-C_16PIN_2MD__073_:TYPE-C_16PIN_2MD__073_: Check availability; AVAILABILITY: Not in stock; CHECK_PRICES: https://www.snapeda.com/parts/TYPE-C%2016PIN%202MD%20(073)/Shouhan/view-part/?ref=eda; DESCRIPTION: DC-5V 5A Type C USB; MF: Shouhan; MP: TYPE-C 16PIN 2MD (073); PACKAGE: Package; PRICE: None; SNAPEDA_LINK: https://www.snapeda.com/parts/TYPE-C%2016PIN%202MD%20(073)/Shouhan/view-part/?ref=snap
J4 = PJ-325C5-G:PJ-325C5-G: Check availability; AVAILABILITY: Not in stock; CHECK_PRICES: https://www.snapeda.com/parts/PJ-325C5-G/XKB+Connection/view-part/?ref=eda; DESCRIPTION: 3.5 Phone Jack; MF: XKB Connection; MP: PJ-325C5-G; PACKAGE: None; PRICE: None; SNAPEDA_LINK: https://www.snapeda.com/parts/PJ-325C5-G/XKB+Connection/view-part/?ref=snap
JP1 JP2 JP5 = pinhead:PINHD-1X2: PIN HEADER
JP3 JP4 JP6 JP8 = pinhead:PINHD-1X4: PIN HEADER
JP7 = pinhead:PINHD-1X3: PIN HEADER
LED2 = led:LED: LED OSRAM: - CHIPLED LG R971, LG N971, LY N971, LG Q971, LY Q971, LO R971, LY R971 LH N974, LH R974 LS Q976, LO Q976, LY Q976 LO Q996 - Hyper CHIPLED LW Q18S LB Q993, LB Q99A, LB R99A - SideLED LS A670, LO A670, LY A670, LG A670, LP A670 LB A673, LV A673, LT A673, LW A673 LH A674 LY A675 LS A676, LA A676, LO A676, LY A676, LW A676 LS A679, LY A679, LG A679 - Hyper Micro SIDELED® LS Y876, LA Y876, LO Y876, LY Y876 LT Y87S - SmartLED LW L88C, LW L88S LB L89C, LB L89S, LG L890 LS L89K, LO L89K, LY L89K LS L896, LA L896, LO L896, LY L896 - TOPLED LS T670, LO T670, LY T670, LG T670, LP T670 LSG T670, LSP T670, LSY T670, LOP T670, LYG T670 LG T671, LOG T671, LSG T671 LB T673, LV T673, LT T673, LW T673 LH T674 LS T676, LA T676, LO T676, LY T676, LB T676, LH T676, LSB T676, LW T676 LB T67C, LV T67C, LT T67C, LS T67K, LO T67K, LY T67K, LW E67C LS E67B, LA E67B, LO E67B, LY E67B, LB E67C, LV E67C, LT E67C LW T67C LS T679, LY T679, LG T679 LS T770, LO T770, LY T770, LG T770, LP T770 LB T773, LV T773, LT T773, LW T773 LH T774 LS E675, LA E675, LY E675, LS T675 LS T776, LA T776, LO T776, LY T776, LB T776 LHGB T686 LT T68C, LB T68C - Hyper Mini TOPLED® LB M676 - Mini TOPLED Santana® LG M470 LS M47K, LO M47K, LY M47K Source: http://www.osram.convergy.de LUXEON: - LUMILED® LXK2-PW12-R00, LXK2-PW12-S00, LXK2-PW14-U00, LXK2-PW14-V00 LXK2-PM12-R00, LXK2-PM12-S00, LXK2-PM14-U00 LXK2-PE12-Q00, LXK2-PE12-R00, LXK2-PE12-S00, LXK2-PE14-T00, LXK2-PE14-U00 LXK2-PB12-K00, LXK2-PB12-L00, LXK2-PB12-M00, LXK2-PB14-N00, LXK2-PB14-P00, LXK2-PB14-Q00 LXK2-PR12-L00, LXK2-PR12-M00, LXK2-PR14-Q00, LXK2-PR14-R00 LXK2-PD12-Q00, LXK2-PD12-R00, LXK2-PD12-S00 LXK2-PH12-R00, LXK2-PH12-S00 LXK2-PL12-P00, LXK2-PL12-Q00, LXK2-PL12-R00 Source: www.luxeon.com KINGBRIGHT: KA-3528ASYC Source: www.kingbright.com
LED3 = led:3535RGB: Full Color PLCC6 LED OVSTRGBBCR8 Source: www.optekinc.com .. ovstrgbbcr8.pdf
MICRO_SD1 = TF-01A:TF-01A: Check availability; AVAILABILITY: Not in stock; CHECK_PRICES: https://www.snapeda.com/parts/TF-01A/HRO+Electronics+Co.%252C+Ltd./view-part/?ref=eda; DESCRIPTION: Standard Card Edge Connectors; MF: HRO Electronics Co., Ltd.; MP: TF-01A; PACKAGE: Package; PRICE: None; SNAPEDA_LINK: https://www.snapeda.com/parts/TF-01A/HRO+Electronics+Co.%252C+Ltd./view-part/?ref=snap
Q3 = crystal-geyer_V1_0:KX: Quartz Crystals (MHz) SMD: KX - Serie Model Size l/w/h [mm] Frequency Range Frequency Stability Temp. Range [°C] Load Capacitance AECQ 200 availabel Datasheet KX-4 KX-5 KX-6 KX-7 KX-9A KX-9B KX-12A KX-12B KX-13 KX-20 KX-K KX-KS 1.6/1.2/0.3 2.0/1.6/0.45 2.5/2.0/0.55 3.2/2.5/0.8 5.0/3.2/1.0 5.0/3.2/1.1 6.0/3.5/1.1 6.0/3.5/1.0 7.0/5.0 /1.3 11.6/5.5/1.6 12.3/4.5/4.2 12.3/4.5/3.2 24.0 ~ 80.0 MHz 16.0 ~ 80.0 MHz 12.0 ~ 80.0 MHz 8.0 ~ 60.0 MHz 7,68 ~ 300,0 MHz 8,0 ~ 50,0 MHz 8,0 ~ 150,0 MHz 8,0 ~ 50,0 MHz 6,0 ~ 160,0 MHz 3,579 ~ 25,0 MHz 3,579 ~ 70,0 MHz 3,579 ~ 70,0 MHz ±10 … ±50ppm ±10 … ±50ppm ±10 … ±50ppm ±10 … ±50ppm ±10 … ±50ppm ±10 … ±50ppm ±10 … ±50ppm ±10 … ±50ppm ±10 … ±50ppm ±50ppm ±10 … ±50ppm ±10 … ±50ppm (*) -40°C …+85°C (*) -40°C …+125°C (*) -40°C …+125°C (*) -40°C …+125°C (*) -40°C …+105°C (*) -40°C …+105°C (*) -40°C …+125°C (*) -40°C …+105°C (*) -40°C …+105°C (*) -40°C …+105°C (*) -40°C …+85°C (*) -40°C …+85°C 8, 8…16 8, 8…16 10, 8…16 12, 7…20 16, 10…20 16, 10…20 16, 10…20 16, 12…20 16, 12…20 16, 12…20 16, 12…30 16, 12…30 - yes yes yes - - - - - - - - KX-4.pdf KX-5.pdf KX-6.pdf KX-7.pdf KX-9A.pdf KX-9B.pdf KX-12A.pdf KX-12B.pdf KX-13.pdf KX-20.pdf KX-K.pdf KX-KS.pdf Details see: http://www.geyer-electronic.de/Frequenz-Produkte.9.0.html Created 2016-06-07, Hans Locher 2016 (C) Geyer Quartz Technology KX4,KX5,KX6,KX7,KX9A,KX9B,KX12A,KX12B,KX13,KX20,KXK,KXKS;1612;2016;2520;3225;5032;6035;7050;11655;12345;1,6x1,2;2,0x1,6;2,5x2,0;3,2x2,5;5,0x3,2;6,0x3,5;7,0x5,0;11,6x5,5;12,3x4,5;12,3x4,5;1.6x1.2;2.0x1.6;2.5x2.0;3.2x2.5;5.0x3.2;6.0x3.5;7.0x5.0;11.6x5.5;12.3x4.5;12.3x4.5;
Q4 = crystal-geyer_V1_0:KX-327: Tuning Fork Crystals (kHz) SMD: KX327 - Serie Model Size l/w/h [mm] Frequency Range Frequency Stability Temp. Range [°C] Load Capacitance AECQ 200 availabel Datasheet KX-327VT KX-327FT KX-327RT KX-327NHT KX-327NHF KX-327L KX-327S 1.25/1.05/0.5 1.6/1.0/0.5 2.0/1.2/0.6 3.2/1.5/0.8 3.2/1.5/0.8 7.0/1.5/1.4 8.2/3.8/2.5 32,768 kHz 32,768 kHz 32,768 kHz 32,768 kHz 32,768 kHz 32,768 kHz 32,768 kHz ±10 … ±20ppm ±10 … ±20ppm ±10 … ±20ppm ±10 … ±20ppm ±10 … ±20ppm ±10 … ±20ppm ±5 … ±20ppm (*) -40°C …+85°C (*) -40°C …+85°C (*) -40°C …+85°C (*) -40°C …+85°C (*) -40°C …+125°C (*) -40°C …+85°C (*) -40°C …+85°C 7/9/12,5 7/9/12,5 7/9/12,6 7/9/12,5 9/12,5 7/9/12,5 6/12,5 - - - - yes - - KX-327VT.pdf KX-327FT.pdf KX-327RT.pdf KX-327NHT.pdf KX-327NHF.pdf KX-327L.pdf KX-327S.pdf Details see: http://www.geyer-electronic.de/Frequenz-Produkte.9.0.html Created 2016-06-07, Hans Locher 2016 (C) Geyer Quartz Technology KX327VT,KX327FT,KX327RT,KX327NHT,KX327NHF,KX327S,KX327L;125105;1610;2012;3215;7015;8238;1,25x1,05,1.25x1.05;1,6x1,0,1.6x1.0;2,0x1,2,2.0x1.2;3,2x1,5,3.2x1.5;8,2x3,8,8.2x3.8,7.0x1.5,7,0x1,532.768kHz
R1-R37 = rcl:R-EU_: RESISTOR, European symbol; SPICEPREFIX: R
S1 = switch-omron:31-XX: OMRON SWITCH; MPN: B3F-3100; OC_FARNELL: 959704; OC_NEWARK: 36M3582
SJ1 = jumper:SJ: SMD solder JUMPER
U1 = AD724JRZ:AD724JRZ: Check availability; AVAILABILITY: In Stock; CHECK_PRICES: https://www.snapeda.com/parts/AD724JR/Analog+Devices/view-part/?ref=eda; DESCRIPTION: Video Encoder IC RGB to NTSC/PAL 16-SOIC; MF: Analog Devices; MP: AD724JR; PACKAGE: SOIC-16 Analog Devices; PRICE: None; SNAPEDA_LINK: https://www.snapeda.com/parts/AD724JR/Analog+Devices/view-part/?ref=snap
U2 = AS6C4008-55SIN:AS6C4008-55SIN: CMOS SRAM Check availability
U3 = MCU-STM32F407VET6_LQFP100_:MCU-STM32F407VET6(LQFP100): Check availability; AVAILABILITY: In Stock; CHECK_PRICES: https://www.snapeda.com/parts/STM32F407VET6/STMicroelectronics/view-part/?ref=eda; DESCRIPTION: ARM® Cortex®-M4 STM32F4 Microcontroller IC 32-Bit Single-Core 168MHz 512KB (512K x 8) FLASH 100-LQFP (14x14); MF: STMicroelectronics; MP: STM32F407VET6; PACKAGE: LQFP-100 STMicroelectronics; PRICE: None; SNAPEDA_LINK: https://www.snapeda.com/parts/STM32F407VET6/STMicroelectronics/view-part/?ref=snap
U4 = SparkFun-IC-Memory:SPI_FLASH-X25XX: 32M Serial Flash Memory 8pin SPI Flash series x25xx. Works with devices like W25X32 and BR25L32 Datasheet SparkFun Products SparkFun Venus GPS Logger (GPS-10920); PROD_ID: IC-09109
U5 = PAM8302AADCR:PAM8302AADCR: Check availability; AVAILABILITY: In Stock; CHECK_PRICES: https://www.snapeda.com/parts/PAM8302AADCR/Diodes+Inc./view-part/?ref=eda; DESCRIPTION: Amplifier IC 1-Channel (Mono) Class D 8-SOP; MF: Diodes Inc.; MP: PAM8302AADCR; PACKAGE: SOP-8 Diodes Inc.; PRICE: None; SNAPEDA_LINK: https://www.snapeda.com/parts/PAM8302AADCR/Diodes+Inc./view-part/?ref=snap
U6 = XC6SLX9-2TQG144C:XC6SLX9-2TQG144C: Check availability; AVAILABILITY: In Stock; CHECK_PRICES: https://www.snapeda.com/parts/XC6SLX9-2TQG144C/Xilinx/view-part/?ref=eda; DESCRIPTION: Spartan®-6 LX Field Programmable Gate Array (FPGA) IC 102 589824 9152 144-LQFP; MF: Xilinx Inc.; MP: XC6SLX9-2TQG144C; PACKAGE: TQFP-144 Xilinx; PRICE: None; SNAPEDA_LINK: https://www.snapeda.com/parts/XC6SLX9-2TQG144C/Xilinx/view-part/?ref=snap
U7-U11 = TXS0108EPWR:TXS0108EPWR: Check availability; AVAILABILITY: In Stock; CHECK_PRICES: https://www.snapeda.com/parts/TXS0108EPWR/Texas+Instruments/view-part/?ref=eda; DESCRIPTION: 8-bit bidirectional voltage-level shifter for open-drain and push-pull application; MF: Texas Instruments; MP: TXS0108EPWR; PACKAGE: TSSOP-20 Texas Instruments; PRICE: None; SNAPEDA_LINK: https://www.snapeda.com/parts/TXS0108EPWR/Texas+Instruments/view-part/?ref=snap
X1 = con-hirschmann:SCART-F: TV SCART CONNECTOR; OC_FARNELL: unknown; OC_NEWARK: unknown
X2 = Jupiter Ace build013:CON-CONRAD_736880-2P: Cinch Connector ( RCA Jack )

## Net classes
1 VCC: width 0.3 mm
2 3,3: width 0.3 mm